# EasyEDA Pro project ProDoc_T527 LPDDR4 4层 模板_2024-06-06.epro, board PCB2
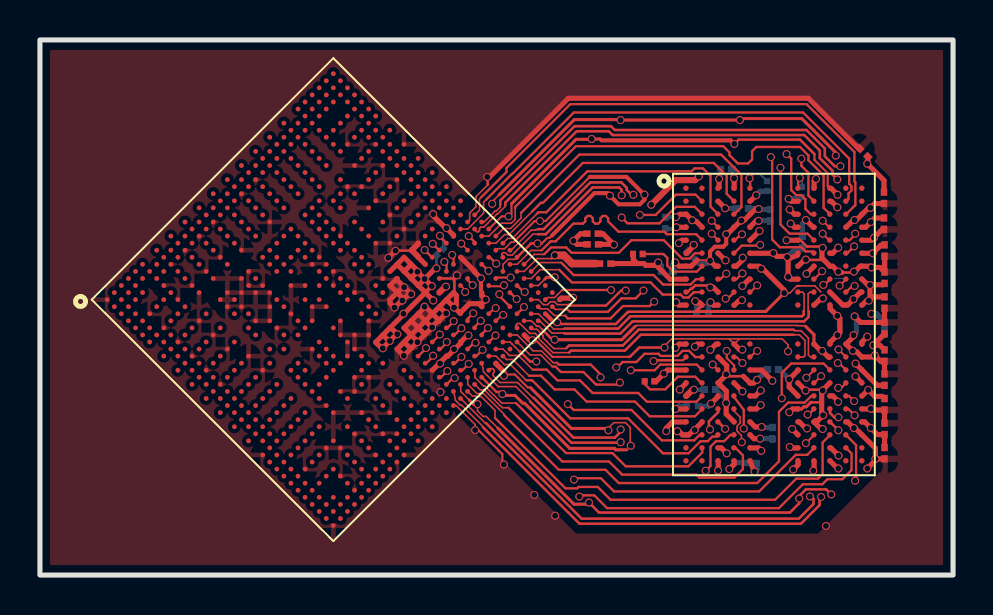
[diagram p1: board, top side]
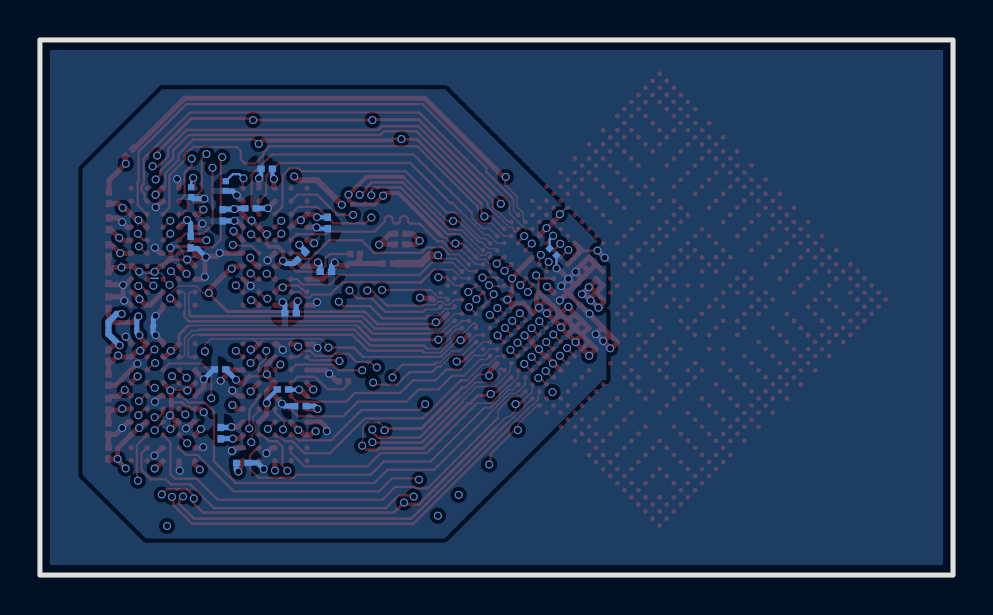
[diagram p2: board, bottom side, seen from below]

Outline 45.69 x 26.8 mm; copper layers: Top Layer, Inner1, Inner2, Bottom Layer. Coordinates in mm from the lower left corner of the outline.
Outline path: rectangle 0,26.8 45.69,0
Stack: Top Layer 0.035mm 外层铜厚1oz / Dielectric1 0.2104mm 7628 RC49% 8.6mil / Inner1 0.0152mm 内层铜厚 / Dielectric2 1.065mm 1.1mm H/HOZ 含铜 / Inner2 0.0152mm 内层铜厚 / Dielectric3 0.2104mm 7628 RC49% 8.6mil / Bottom Layer 0.035mm 外层铜厚1oz

## Design rules (mm)
template: 6L BGA
spacing safeClearance (default): track to track 0.076, other pairs 0.076 to 0.3
track width trackWidth (default): min 0.076, default 0.102, max 2.54
differential pair differentialPair (default): width min 0.102, default 0.254, max 2.54; gap min 0.102, default 0.102
via viaSize (default): diameter min 0.381, default 0.45, max 10; hole min 0.201, default 0.201, max 5.999
net GND uses DRAMCopper
pour e3959 uses DRAMCopper
pour e3975 uses DRAMCopper

## Placement (name value [footprint] x y rotation side)
C1  2.2uF  [c0201 nsk]  42.27 13.64 270 top
C2  2.2uF  [c0201 nsk]  42.27 6.1 270 top
C3  100nF  [c0201 nsk]  42.27 14.88 270 top
C4  100nF  [c0201 nsk]  42.27 9.78 270 top
C5  100nF  [c0201 nsk]  28.3 15.6 0 top
C6  2.2uF  [c0201 nsk]  41.22 21.16 135 top
C7  100nF  [c0201 nsk]  42.24 18.9 90 top
C8  2.2uF  [c0201 nsk]  42.27 12.37 90 top
C9  100nF  [c0201 nsk]  42.27 16.26 90 top
C10  100nF  [c0201 nsk]  32.61 15.98 135 bottom
C11  100nF  [c0201 nsk]  42.27 8.56 90 top
C12  100nF  [c0201 nsk]  42.27 11 90 top
C13  100nF  [c0201 nsk]  33.53 9.3 180 bottom
C14  2.2uF  [c0201 nsk]  34.34 20.34 180 bottom
C15  2.2uF  [c0201 nsk]  33.15 13.11 180 bottom
C16  100nF  [c0201 nsk]  31.29 17.63 270 bottom
C17  100nF  [c0201 nsk]  42.24 17.6 90 top
C18  100nF  [c0201 nsk]  42.27 7.31 270 top
C19  2.2uF  [c0201 nsk]  31.39 15.19 0 bottom
C20  100nF  [c0201 nsk]  36.68 10.3 0 bottom
C21  100nF  [c0201 nsk]  35.56 5.61 180 bottom
C22  100nF  [c0201 nsk]  32.66 8.46 0 bottom
C23  100nF  [c0201 nsk]  38.15 16.66 270 bottom
C24  100nF  [c0201 nsk]  36.65 7.11 90 bottom
C25  100nF  [c0201 nsk]  36.55 18.01 270 bottom
C26  100nF  [c0201 nsk]  35.15 18.36 180 bottom
C27  2.2uF  [c0201 nsk]  27.66 17.09 0 top
C28  100nF  [c0201 nsk]  27.66 16.56 180 top
R1  0  [r0201 nsk]  29.92 16.08 180 top
R2  0  [r0201 nsk]  30.51 9.7 0 top
R3  120  [r0201 nsk]  20.01 16.18 225 bottom
R4  240  [r0201 nsk]  36.4 19.48 270 bottom
R5  240  [r0201 nsk]  38.13 19.18 270 bottom
U1  T527  [T527-BGA664]  14.68 13.79 45 top
UD1  LPDDR4_FBGA200  [BGA200P65_80B1000_1500H90]  36.73 12.55 0 top

## Footprints (pads in the part's own frame, mm; a bottom-side part is the same pattern mirrored in y, then rotated)
BGA200P65_80B1000_1500H90
  round 0.27 smd: A1(-4.4,6.825) A2(-3.6,6.825) A3(-2.8,6.825) A4(-2,6.825) A5(-1.2,6.825) A8(1.2,6.825) A9(2,6.825) A10(2.8,6.825) A11(3.6,6.825) A12(4.4,6.825) AA1(-4.4,-6.175) AA2(-3.6,-6.175) AA3(-2.8,-6.175) AA4(-2,-6.175) AA5(-1.2,-6.175) AA8(1.2,-6.175) AA9(2,-6.175) AA10(2.8,-6.175) AA11(3.6,-6.175) AA12(4.4,-6.175) AB1(-4.4,-6.825) AB2(-3.6,-6.825) AB3(-2.8,-6.825) AB4(-2,-6.825) AB5(-1.2,-6.825) AB8(1.2,-6.825) AB9(2,-6.825) AB10(2.8,-6.825) AB11(3.6,-6.825) AB12(4.4,-6.825) B1(-4.4,6.175) B2(-3.6,6.175) B3(-2.8,6.175) B4(-2,6.175) B5(-1.2,6.175) B8(1.2,6.175) B9(2,6.175) B10(2.8,6.175) B11(3.6,6.175) B12(4.4,6.175) C1(-4.4,5.525) C2(-3.6,5.525) C3(-2.8,5.525) C4(-2,5.525) C5(-1.2,5.525) C8(1.2,5.525) C9(2,5.525) C10(2.8,5.525) C11(3.6,5.525) C12(4.4,5.525) D1(-4.4,4.875) D2(-3.6,4.875) D3(-2.8,4.875) D4(-2,4.875) D5(-1.2,4.875) D8(1.2,4.875) D9(2,4.875) D10(2.8,4.875) D11(3.6,4.875) D12(4.4,4.875) E1(-4.4,4.225) E2(-3.6,4.225) E3(-2.8,4.225) E4(-2,4.225) E5(-1.2,4.225) E8(1.2,4.225) E9(2,4.225) E10(2.8,4.225) E11(3.6,4.225) E12(4.4,4.225) F1(-4.4,3.575) F2(-3.6,3.575) F3(-2.8,3.575) F4(-2,3.575) F5(-1.2,3.575) F8(1.2,3.575) F9(2,3.575) F10(2.8,3.575) F11(3.6,3.575) F12(4.4,3.575) G1(-4.4,2.925) G2(-3.6,2.925) G3(-2.8,2.925) G4(-2,2.925) G5(-1.2,2.925) G8(1.2,2.925) G9(2,2.925) G10(2.8,2.925) G11(3.6,2.925) G12(4.4,2.925) H1(-4.4,2.275) H2(-3.6,2.275) H3(-2.8,2.275) H4(-2,2.275) H5(-1.2,2.275) H8(1.2,2.275) H9(2,2.275) H10(2.8,2.275) H11(3.6,2.275) H12(4.4,2.275) J1(-4.4,1.625) J2(-3.6,1.625) J3(-2.8,1.625) J4(-2,1.625) J5(-1.2,1.625) J8(1.2,1.625) J9(2,1.625) J10(2.8,1.625) J11(3.6,1.625) J12(4.4,1.625) K1(-4.4,0.975) K2(-3.6,0.975) K3(-2.8,0.975) K4(-2,0.975) K5(-1.2,0.975) K8(1.2,0.975) K9(2,0.975) K10(2.8,0.975) K11(3.6,0.975) K12(4.4,0.975) N1(-4.4,-0.975) N2(-3.6,-0.975) N3(-2.8,-0.975) N4(-2,-0.975) N5(-1.2,-0.975) N8(1.2,-0.975) N9(2,-0.975) N10(2.8,-0.975) N11(3.6,-0.975) N12(4.4,-0.975) P1(-4.4,-1.625) P2(-3.6,-1.625) P3(-2.8,-1.625) P4(-2,-1.625) P5(-1.2,-1.625) P8(1.2,-1.625) P9(2,-1.625) P10(2.8,-1.625) P11(3.6,-1.625) P12(4.4,-1.625) R1(-4.4,-2.275) R2(-3.6,-2.275) R3(-2.8,-2.275) R4(-2,-2.275) R5(-1.2,-2.275) R8(1.2,-2.275) R9(2,-2.275) R10(2.8,-2.275) R11(3.6,-2.275) R12(4.4,-2.275) T1(-4.4,-2.925) T2(-3.6,-2.925) T3(-2.8,-2.925) T4(-2,-2.925) T5(-1.2,-2.925) T8(1.2,-2.925) T9(2,-2.925) T10(2.8,-2.925) T11(3.6,-2.925) T12(4.4,-2.925) U1(-4.4,-3.575) U2(-3.6,-3.575) U3(-2.8,-3.575) U4(-2,-3.575) U5(-1.2,-3.575) U8(1.2,-3.575) U9(2,-3.575) U10(2.8,-3.575) U11(3.6,-3.575) U12(4.4,-3.575) V1(-4.4,-4.225) V2(-3.6,-4.225) V3(-2.8,-4.225) V4(-2,-4.225) V5(-1.2,-4.225) V8(1.2,-4.225) V9(2,-4.225) V10(2.8,-4.225) V11(3.6,-4.225) V12(4.4,-4.225) W1(-4.4,-4.875) W2(-3.6,-4.875) W3(-2.8,-4.875) W4(-2,-4.875) W5(-1.2,-4.875) W8(1.2,-4.875) W9(2,-4.875) W10(2.8,-4.875) W11(3.6,-4.875) W12(4.4,-4.875) Y1(-4.4,-5.525) Y2(-3.6,-5.525) Y3(-2.8,-5.525) Y4(-2,-5.525) Y5(-1.2,-5.525) Y8(1.2,-5.525) Y9(2,-5.525) Y10(2.8,-5.525) Y11(3.6,-5.525) Y12(4.4,-5.525)
c0201 nsk
  rect 0.368x0.324 smd: 1(-0.292,0) 2(0.28,0)
r0201 nsk
  rect 0.303x0.324 smd: 1(-0.241,0) 2(0.241,0)
T527-BGA664
  round 0.239 smd: A1(-8,8) A2(-7.5,8) A3(-7,8) A4(-6.5,8) A5(-6,8) A6(-5.5,8) A8(-4.5,8) A10(-3.5,8) A12(-2.5,8) A14(-1.5,8) A16(-0.5,8) A18(0.5,8) A20(1.5,8) A22(2.5,8) A24(3.5,8) A26(4.5,8) A28(5.5,8) A29(6,8) A30(6.5,8) A31(7,8) A32(7.5,8) A33(8,8) AA1(-8,-2) AA2(-7.5,-2) AA3(-7,-2) AA4(-6.5,-2) AA5(-6,-2) AA6(-5.5,-2) AA7(-5,-2) AA9(-4,-2) AA12(-2.5,-2) AA13(-2,-2) AA15(-1,-2) AA16(-0.5,-2) AA18(0.5,-2) AA19(1,-2) AA21(2,-2) AA22(2.5,-2) AA24(3.5,-2) AA26(4.5,-2) AA27(5,-2) AA28(5.5,-2) AA29(6,-2) AA30(6.5,-2) AA31(7,-2) AA32(7.5,-2) AA33(8,-2) AB2(-7.5,-2.501) AB3(-7,-2.5) AB9(-4,-2.501) AB10(-3.5,-2.5) AB11(-3,-2.5) AB12(-2.5,-2.5) AB13(-2,-2.5) AB14(-1.5,-2.5) AB15(-1,-2.5) AB17(0,-2.5) AB24(3.5,-2.5) AB32(7.5,-2.501) AB33(8,-2.5) AC1(-8,-3) AC2(-7.5,-3) AC3(-7,-3) AC4(-6.5,-3) AC5(-6,-3) AC6(-5.5,-3) AC7(-5,-3) AC9(-4,-3) AC15(-1,-3) AC17(0,-3) AC18(0.5,-3) AC19(1,-3) AC20(1.5,-3) AC22(2.5,-3) AC24(3.5,-3) AC26(4.5,-3) AC27(5,-3) AC28(5.5,-3) AC29(6,-3) AC30(6.5,-3) AC31(7,-3) AC32(7.5,-3) AC33(8,-3) AD1(-8,-3.5) AD2(-7.5,-3.5) AD9(-4,-3.5) AD11(-3,-3.5) AD13(-2,-3.5) AD14(-1.5,-3.5) AD15(-1,-3.5) AD20(1.5,-3.5) AD21(2,-3.5) AD22(2.5,-3.5) AD25(4,-3.5) AD32(7.5,-3.5) AD33(8,-3.5) AE1(-8,-4) AE2(-7.5,-4) AE3(-7,-4) AE4(-6.5,-4) AE5(-6,-4) AE6(-5.5,-4) AE7(-5,-4) AE9(-4,-4) AE11(-3,-4) AE12(-2.501,-4) AE13(-2,-4) AE14(-1.5,-4) AE16(-0.5,-4) AE18(0.5,-4) AE19(1,-4) AE20(1.5,-4) AE21(2,-4) AE22(2.501,-4) AE23(3,-4) AE24(3.5,-4) AE25(4,-4) AE26(4.5,-4) AE27(5,-4) AE28(5.5,-4) AE29(6,-4) AE30(6.5,-4) AE31(7,-4) AE32(7.5,-4) AE33(8,-4) AF1(-8,-4.5) AF2(-7.5,-4.5) AF32(7.5,-4.5) AF33(8,-4.5) AG1(-8,-5) AG2(-7.5,-5) AG3(-7,-5) AG4(-6.5,-5) AG5(-6,-5) AG6(-5.5,-5) AG7(-5,-5) AG9(-4,-5) AG11(-3,-5) AG13(-2,-5) AG15(-1,-5) AG17(0,-5) AG19(1,-5) AG21(2,-5) AG23(3,-5) AG25(4,-5) AG28(5.5,-5) AG29(6,-5) AG30(6.5,-5) AG31(7,-5) AG32(7.5,-5) AG33(8,-5) AH1(-8,-5.5) AH2(-7.5,-5.5) AH7(-5,-5.5) AH9(-4,-5.5) AH11(-3,-5.5) AH13(-2,-5.5) AH15(-1,-5.5) AH17(0,-5.5) AH19(1,-5.5) AH21(2,-5.5) AH23(3,-5.5) AH25(4,-5.5) AH27(5,-5.5) AH32(7.5,-5.5) AH33(8,-5.5) AJ1(-8,-6) AJ2(-7.5,-6) AJ3(-7,-6) AJ4(-6.5,-6) AJ5(-6,-6) AJ7(-5,-6) AJ9(-4,-6) AJ11(-3,-6) AJ13(-2,-6) AJ15(-1,-6) AJ17(0,-6) AJ19(1,-6) AJ21(2,-6) AJ23(3,-6) AJ25(4,-6) AJ27(5,-6) AJ30(6.5,-6) AJ31(7,-6) AJ32(7.5,-6) AJ33(8,-6) AK1(-8,-6.5) AK2(-7.5,-6.5) AK5(-6,-6.5) AK7(-5,-6.5) AK9(-4,-6.5) AK11(-3,-6.5) AK13(-2,-6.5) AK15(-1,-6.5) AK17(0,-6.501) AK19(1,-6.5) AK21(2,-6.5) AK23(3,-6.5) AK25(4,-6.5) AK27(5,-6.5) AK29(6,-6.5) AK32(7.5,-6.5) AK33(8,-6.5) AL1(-8,-7) AL2(-7.5,-7) AL3(-7,-7) AL5(-6,-7) AL7(-5,-7) AL9(-4,-7) AL11(-3,-7) AL12(-2.5,-7) AL13(-2,-7) AL14(-1.5,-7) AL15(-1,-7) AL16(-0.5,-7) AL17(0,-7) AL19(1,-7) AL21(2,-7) AL23(3,-7) AL25(4,-7) AL27(5,-7) AL29(6,-7) AL31(7,-7) AL32(7.5,-7) AL33(8,-7) AM1(-8,-7.5) AM2(-7.5,-7.5) AM3(-7,-7.5) AM4(-6.5,-7.5) AM5(-6,-7.5) AM6(-5.5,-7.5) AM7(-5,-7.5) AM8(-4.5,-7.5) AM9(-4,-7.5) AM10(-3.5,-7.5) AM11(-3,-7.5) AM12(-2.501,-7.5) AM13(-2,-7.5) AM14(-1.5,-7.5) AM15(-1,-7.5) AM16(-0.5,-7.5) AM17(0,-7.5) AM18(0.5,-7.5) AM19(1,-7.5) AM20(1.5,-7.5) AM21(2,-7.5) AM22(2.501,-7.5) AM23(3,-7.5) AM24(3.5,-7.5) AM25(4,-7.5) AM26(4.5,-7.5) AM27(5,-7.5) AM28(5.5,-7.5) AM29(6,-7.5) AM30(6.5,-7.5) AM31(7,-7.5) AM32(7.5,-7.5) AM33(8,-7.5) AN1(-8,-8) AN2(-7.5,-8) AN3(-7,-8) AN4(-6.5,-8) AN5(-6,-8) AN6(-5.5,-8) AN7(-5,-8) AN8(-4.5,-8) AN9(-4,-8) AN10(-3.5,-8) AN11(-3,-8) AN13(-2,-8) AN15(-1,-8) AN17(0,-8) AN18(0.5,-8) AN19(1,-8) AN20(1.5,-8) AN21(2,-8) AN22(2.5,-8) AN23(3,-8) AN24(3.5,-8) AN25(4,-8) AN26(4.5,-8) AN27(5,-8) AN28(5.5,-8) AN29(6,-8) AN30(6.5,-8) AN31(7,-8) AN32(7.5,-8) AN33(8,-8) B1(-8,7.5) B2(-7.5,7.5) B3(-7,7.5) B4(-6.5,7.5) B5(-6,7.5) B6(-5.5,7.5) B7(-5,7.5) B8(-4.5,7.5) B9(-4,7.5) B10(-3.5,7.5) B11(-3,7.5) B12(-2.501,7.5) B13(-2,7.5) B14(-1.5,7.5) B15(-1,7.5) B16(-0.5,7.5) B17(0,7.5) B18(0.5,7.5) B19(1,7.5) B20(1.5,7.5) B21(2,7.5) B22(2.501,7.5) B23(3,7.5) B24(3.5,7.5) B25(4,7.5) B26(4.5,7.5) B27(5,7.5) B28(5.5,7.5) B29(6,7.5) B30(6.5,7.5) B31(7,7.5) B32(7.5,7.5) B33(8,7.5) C1(-8,7) C2(-7.5,7) C3(-7,7) C4(-6.5,7) C6(-5.5,7) C7(-5,7) C8(-4.5,7) C9(-4,7) C10(-3.5,7) C11(-3,7) C12(-2.5,7) C13(-2,7) C14(-1.5,7) C15(-1,7) C16(-0.5,7) C17(0,7) C18(0.5,7) C19(1,7) C20(1.5,7) C21(2,7) C22(2.5,7) C23(3,7) C24(3.5,7) C25(4,7) C26(4.5,7) C27(5,7) C28(5.5,7) C29(6,7) C30(6.5,7) C31(7,7) C32(7.5,7) C33(8,7) D1(-8,6.5) D2(-7.5,6.5) D6(-5.5,6.5) D8(-4.5,6.5) D10(-3.5,6.5) D12(-2.5,6.501) D14(-1.5,6.5) D16(-0.5,6.5) D18(0.5,6.5) D20(1.5,6.5) D22(2.5,6.501) D24(3.5,6.5) D26(4.5,6.5) D28(5.5,6.5) D32(7.5,6.5) D33(8,6.5) E1(-8,6) E2(-7.5,6) E3(-7,6) E4(-6.5,6) E5(-6,6) E6(-5.5,6) E8(-4.5,6) E10(-3.5,6) E12(-2.5,6) E14(-1.5,6) E16(-0.5,6) E18(0.5,6) E20(1.5,6) E22(2.5,6) E24(3.5,6) E26(4.5,6) E28(5.5,6) E29(6,6) E30(6.5,6) E31(7,6) E32(7.5,6) E33(8,6) F1(-8,5.5) F2(-7.5,5.5) F6(-5.5,5.5) F8(-4.5,5.5) F10(-3.5,5.5) F12(-2.5,5.5) F14(-1.5,5.5) F16(-0.5,5.5) F18(0.5,5.5) F20(1.5,5.5) F22(2.5,5.5) F24(3.5,5.5) F26(4.5,5.5) F28(5.5,5.5) F32(7.5,5.5) F33(8,5.5) G1(-8,5) G2(-7.5,5) G3(-7,5) G4(-6.5,5) G5(-6,5) G6(-5.5,5) G8(-4.5,5) G10(-3.5,5) G12(-2.5,5) G14(-1.5,5) G16(-0.5,5) G18(0.5,5) G20(1.5,5) G22(2.5,5) G24(3.5,5) G26(4.5,5) G28(5.5,5) G29(6,5) G30(6.5,5) G31(7,5) G32(7.5,5) G33(8,5) H2(-7.5,4.5) H3(-7,4.5) H24(3.5,4.5) H31(7,4.5) H32(7.5,4.5) J1(-8,4) J2(-7.5,4) J3(-7,4) J4(-6.5,4) J5(-6,4) J6(-5.5,4) J7(-5,4) J9(-4,4) J10(-3.5,4) J12(-2.501,4) J13(-2,4) J15(-1,4) J16(-0.5,4) J17(0,4) J18(0.5,4) J19(1,4) J21(2,4) J22(2.501,4) J23(3,4) J26(4.5,4) J28(5.5,4) J29(6,4) J30(6.5,4) J31(7,4) J32(7.5,4) J33(8,4) K2(-7.5,3.5) K3(-7,3.5) K9(-4,3.5) K10(-3.5,3.5) K11(-3,3.5) K12(-2.5,3.5) K13(-2,3.5) K15(-1,3.5) K16(-0.5,3.5) K19(1,3.5) K21(2,3.5) K22(2.5,3.5) K24(3.5,3.5) K25(4,3.5) K26(4.5,3.5) K31(7,3.5) K32(7.5,3.5) L1(-8,3) L2(-7.5,3) L3(-7,3) L4(-6.5,3) L5(-6,3) L6(-5.5,3) L7(-5,3) L9(-4,3) L10(-3.5,3) L12(-2.5,3) L13(-2,3) L15(-1,3) L16(-0.5,3) L17(0,3) L18(0.5,3) L19(1,3) L21(2,3) L22(2.5,3) L24(3.5,3) L26(4.5,3) L27(5,3) L28(5.5,3) L29(6,3) L30(6.5,3) L31(7,3) L32(7.5,3) L33(8,3) M2(-7.5,2.501) M3(-7,2.5) M10(-3.5,2.5) M13(-2,2.5) M16(-0.5,2.5) M18(0.5,2.5) M19(1,2.5) M21(2,2.5) M22(2.5,2.5) M31(7,2.5) M32(7.5,2.501) N1(-8,2) N2(-7.5,2) N3(-7,2) N4(-6.5,2) N5(-6,2) N6(-5.5,2) N7(-5,2) N9(-4,2) N10(-3.5,2) N12(-2.5,2) N13(-2,2) N15(-1,2) N18(0.5,2) N19(1,2) N21(2,2) N22(2.5,2) N24(3.5,2) N26(4.5,2) N27(5,2) N28(5.5,2) N29(6,2) N30(6.5,2) N31(7,2) N32(7.5,2) N33(8,2) P2(-7.5,1.5) P3(-7,1.5) P9(-4,1.5) P11(-3,1.5) P13(-2,1.5) P16(-0.5,1.5) P18(0.5,1.5) P19(1,1.5) P21(2,1.5) P22(2.5,1.5) P24(3.5,1.5) P31(7,1.5) P32(7.5,1.5) R1(-8,1) R2(-7.5,1) R3(-7,1) R4(-6.5,1) R5(-6,1) R6(-5.5,1) R7(-5,1) R11(-3,1) R13(-2,1) R15(-1,1) R17(0,1) R18(0.5,1) R19(1,1) R22(2.5,1) R24(3.5,1) R26(4.5,1) R27(5,1) R28(5.5,1) R29(6,1) R30(6.5,1) R31(7,1) R32(7.5,1) R33(8,1) T2(-7.5,0.5) T3(-7,0.5) T9(-4,0.5) T11(-3,0.5) T13(-2,0.5) T15(-1,0.5) T16(-0.5,0.5) T18(0.5,0.5) T19(1,0.5) T21(2,0.5) T22(2.5,0.5) T24(3.5,0.5) T31(7,0.5) T32(7.5,0.5) U1(-8,0) U2(-7.5,0) U3(-7,0) U4(-6.501,0) U5(-6,0) U6(-5.5,0) U7(-5,0) U8(-4.5,0) U10(-3.5,0) U12(-2.5,0) U13(-2,0) U14(-1.5,0) U16(-0.5,0) U18(0.5,0) U19(1,0) U21(2,0) U22(2.5,0) U25(4,0) U26(4.5,0) U27(5,0) U28(5.5,0) U29(6,0) U30(6.501,0) U31(7,0) U32(7.5,0) U33(8,0) V2(-7.5,-0.5) V3(-7,-0.5) V18(0.5,-0.5) V19(1,-0.5) V31(7,-0.5) V32(7.5,-0.5) W1(-8,-1) W2(-7.5,-1) W3(-7,-1) W4(-6.5,-1) W5(-6,-1) W6(-5.5,-1) W7(-5,-1) W9(-4,-1) W10(-3.5,-1) W12(-2.5,-1) W13(-2,-1) W15(-1,-1) W16(-0.5,-1) W19(1,-1) W21(2,-1) W22(2.5,-1) W23(3,-1) W24(3.5,-1) W25(4,-1) W27(5,-1) W28(5.5,-1) W29(6,-1) W30(6.5,-1) W31(7,-1) W32(7.5,-1) W33(8,-1) Y2(-7.5,-1.5) Y3(-7,-1.5) Y9(-4,-1.5) Y10(-3.5,-1.5) Y12(-2.5,-1.5) Y13(-2,-1.5) Y15(-1,-1.5) Y18(0.5,-1.5) Y19(1,-1.5) Y21(2,-1.5) Y22(2.5,-1.5) Y23(3,-1.5) Y24(3.5,-1.5) Y26(4.5,-1.5) Y31(7,-1.5) Y32(7.5,-1.5)

## Nets
As in the schematic.

Pads without a net: U1 A2 A3 A4 A5 A6 A8 A10 A12 A14 A16 A18 A20 A22 A24 A26 A28 A29 A30 A31 A32 A33 AA1 AA2 AA3 AA4 AA5 AA6 AA7 AA9 AA12 AA13 AA19 AB2 AB3 AB9 AB13 AC2 AC3 AC4 AC5 AC6 AC7 AC9 AC15 AD1 AD2 AD15 AE1 AE2 AE3 AE4 AE5 AE6 AE7 AE11 AE13 AE16 AF1 AF2 AG1 AG2 AG4 AG5 AG9 AG13 AG15 AG17 AH1 AH2 AH11 AH13 AH15 AH17 AJ1 AJ2 AJ3 AJ4 AJ5 AJ7 AJ9 AJ11 AJ15 AJ17 AK1 AK2 AK7 AK9 AK13 AK15 AK17 AK33 AL1 AL2 AL5 AL7 AL11 AL15 AL16 AL17 AL27 AL32 AL33 AM1 AM2 AM3 AM4 AM6 AM7 AM8 AM9 AM10 AM11 AM12 AM13 AM14 AM15 AM16 AM17 AM18 AM33 AN2 AN3 AN4 AN5 AN6 AN7 AN8 AN9 AN13 AN15 AN17 AN26 B1 B2 B3 B4 B5 B6 B7 B8 B9 B10 B11 B12 B13 B14 B15 B16 B17 B18 B19 B20 B21 B22 B23 B24 B25 B26 B27 B28 B29 B30 B31 B32 B33 C1 C2 C3 C4 C7 C9 C11 C13 C15 C16 C17 C19 C21 C22 C23 C24 C25 C26 C27 C28 C29 C30 C31 C32 C33 D1 D2 D8 D10 D12 D14 D16 D18 D20 D22 D24 D26 D28 D32 D33 E1 E2 E4 E5 E6 E8 E10 E12 E14 E16 E18 E20 E22 E24 E26 E28 E29 E30 E31 E32 E33 F1 F2 F14 F16 F18 F20 F22 F24 F26 F28 F32 F33 G1 G2 G4 G5 G6 G12 G16 G20 G22 G24 G26 G28 G30 G31 G32 G33 H2 H3 H24 H31 H32 J1 J2 J4 J5 J7 J15 J16 J17 J18 J19 J21 J22 J23 J26 J29 J30 J32 J33 K2 K3 K13 K15 K16 K19 K21 K22 K24 K25 K31 K32 L1 L2 L4 L5 L7 L9 L15 L16 L17 L18 L19 L21 L22 L24 L26 L28 L29 L31 L32 M2 M3 M10 M16 M18 M19 M21 M22 M31 M32 N1 N2 N4 N5 N7 N9 N13 N21 N24 N28 N29 N31 N32 N33 P2 P3 P9 P13 P18 P21 P22 P31 P32 R1 R2 R4 R5 R6 R15 R17 R18 R22 R26 R28 R29 R30 R31 R32 R33 T2 T3 T9 T11 T13 T19 T21 T22 T31 T32 U1 U2 U3 U4 U5 U6 U8 U10 U12 U13 U18 U19 U21 U22 U26 U28 U29 U30 U31 U32 U33 V2 V3 V31 V32 W1 W2 W3 W4 W5 W6 W7 W9 W10 W19 W21 W28 W29 W31 W32 W33 Y2 Y3 Y9 Y10 Y12 Y13 Y19 Y21 Y31 Y32; UD1 A1 A2 A11 A12 AA1 AA12 AB1 AB2 AB11 AB12 B1 B12 G11 K5 K8 N5 N8

## Via types
v1: diameter 0.4, hole 0.3, Top Layer to Bottom Layer, 283 vias

## Routing (per net, layer and track width the routed paths; a pad name or vN(x,y) marks a point on that pad's centre or on a via; arc(x,y) is an arc through that point)
GND: length 299.7
  Top Layer w0.076: 21.41,17.68 21.5,17.78 21.5,18.13 21.82,18.45 21.82,18.95 22.41,19.54 ; 35,11.83 34.74,11.57 34.48,11.83 ; 35,11.83 34.48,11.83 ; 35,11.83 37.14,11.83 37.44,11.53 v1(37.44,11.2) ; v1(33.53,15.74) 33.5,15.77 32.9,15.77 ; v1(29.57,6.48) 29.54,6.5 29.54,7.39 29.3,7.63 28.71,7.63 28.42,7.34 ; 25.26,14.82 24.94,14.5 24.59,14.5 ; 23.88,15.21 24.24,15.21 24.88,15.85 25.61,15.85 ; 25.14,12.29 24.96,12.47 24.87,12.47 24.84,12.48 24.59,12.73 24.24,12.73 ; 22.39,19.93 v1(22.38,19.94) 22.37,19.94 22.37,19.79 ; 38.29,12.49 37.91,12.49 37.9,12.5 29.88,12.5 29.87,12.49 29.82,12.49 ; 23.7,16.67 23.58,16.67 23.25,16.34 22.9,16.34 22.82,16.27 ; 23.17,15.21 23.17,15.56 23.43,15.81 23.78,15.81 23.88,15.91 ; v1(37.24,14.12) 37.52,14.12 37.88,14.48 37.89,14.48 ; 20.7,8.49 20.83,8.49 21.78,7.54 v1(21.78,7.26) ; 39.06,14.17 39.06,14.2 38.78,14.48 38.01,14.48 ; 34.48,11.83 31.61,11.83 31.26,11.47 v1(31.26,11.39) ; v1(28.45,7.25) 28.54,7.25 ; 22.92,7.36 22.33,7.94 22.18,7.94 21.89,8.23 v1(21.89,8.56) ; v1(22.63,18.59) 22.63,18.7 22.97,19.04 ; 21.05,9.55 21.05,9.2 21.49,8.76 ; 24,11.2 23.78,11.42 23.78,11.42 23.63,11.57 23.63,11.57 23.52,11.67 23.17,11.67
  Top Layer w0.102: 23.7,16.67 24.75,17.72 25.01,17.72 v1(25.02,17.73) 25.31,17.73 27.52,19.94 ; 29.48,10.93 25.65,10.93 24.81,11.76 v1(24.65,11.76) ; 23.6,18.59 23.6,18.1 v1(23.45,17.96) 23.45,17.96 23.1,17.96 22.47,17.33 ; 38.29,12.49 38.33,12.45 ; v1(23.22,5.54) 23.14,5.61 23.14,6.06 22.97,6.23 22.97,6.23 21.94,7.26 v1(21.78,7.26) ; 24.56,9.37 24.54,9.4 24.41,9.4 23.76,10.05 23.11,10.05 ; 37.89,14.48 38.01,14.48 ; 38.76,21.08 38.76,20.79 39.42,20.13 39.42,19.49 39.54,19.37 ; v1(24.9,16.61) 25.12,16.61 25.39,16.88 25.46,16.88 25.48,16.9 25.52,16.9 25.62,17 ; 31.55,10.76 32.18,10.76 32.34,10.92 ; 29.78,12.45 29.82,12.49
  Top Layer w0.115: v1(23.14,9.07) 23.04,9.17 22.85,9.17 22.11,9.9
  Top Layer w0.127: 25.61,15.85 v1(25.77,16.01) ; 40.13,15.15 40.73,15.15 ; 38.76,21.08 38.03,21.81 34.96,21.81 v1(34.75,21.59) ; 35.2,9.96 34.44,9.96 v1(34.34,10.05) ; v1(30.71,10.72) 30.75,10.76 31.55,10.76 ; 20.74,14.88 20.74,14.19 20.7,14.15 ; 20.74,14.88 v1(20.87,15.01) ; 20.74,14.88 20.71,14.85 19.99,14.85 ; 24,11.2 24.03,11.2 24.53,10.69 v1(24.84,10.69) ; v1(39.17,9.25) 39.14,9.28 38.36,9.28 v1(38.32,9.24) ; v1(27.47,3.63) 27.98,3.13 37.53,3.13 38,3.6 v1(38,3.84) 38,3.96 38.33,4.29 39.34,4.29 v1(39.6,4.04) ; 18.6,16.24 17.8,16.24 v1(17.79,16.25) ; 39.12,8.67 39.1,8.65 38.63,8.65 ; 32.95,13.21 32.92,13.19 29.46,13.19 29.42,13.15 29.4,13.15 28.82,12.57 25.97,12.57 v1(25.88,12.66) ; v1(39.17,16.38) 39.12,16.38 39.05,16.45 38.38,16.45 38.06,16.77 37.94,16.77 ; v1(31.26,11.39) 29.99,11.39 29.52,10.93 29.48,10.93 ; 25.14,12.29 25.64,11.79 v1(25.76,11.79) ; 23.88,15.91 24.58,16.61 v1(24.9,16.61) ; 39.23,15.78 38.35,15.78 v1(38.33,15.8) ; 32.34,14.17 32.4,14.17 32.59,14.35 32.64,14.35 32.79,14.5 33.45,14.5 v1(33.54,14.41) ; 22.41,19.54 22.41,19.84 22.36,19.89 22.39,19.93
  Top Layer w0.152: 29.78,12.45 29.12,11.79 v1(25.76,11.79) ; 22.97,19.04 26.74,22.81 28.93,22.81 28.96,22.78 v1(29.06,22.78) v1(35.03,22.78) 35.1,22.86 38.12,22.86 39.83,21.16 v1(39.83,21.01) ; 28.11,21.77 28.04,21.84 v1(27.61,21.84) 27.59,21.82 26.82,21.82 23.6,18.59 ; 28.42,7.34 26.59,7.34 24.56,9.37 ; UD1.N9 38.74,11.58 38.74,12.04 38.33,12.45 ; v1(25.76,14.91) 25.35,14.91 25.26,14.82 ; v1(27.47,3.63) 27.42,3.63 27.33,3.55 26.72,3.55 22.92,7.36 ; 21.49,8.76 21.69,8.56 v1(21.89,8.56) ; v1(23.14,9.07) 23.21,9 23.77,9 24.16,8.6 24.25,8.6 26.51,6.34 28.75,6.34 28.82,6.27 29.36,6.27 ; 38.63,8.65 38.58,8.65 38.36,8.43 38.22,8.43 38.11,8.32 37.94,8.32 ; 33.14,13.52 32.83,13.2 36.32,13.2 v1(37.24,14.12)
  Top Layer w0.203: 27.52,19.94 29.35,19.94 30.24,19.05 v1(30.25,19.05) 30.25,18.8 30.02,18.57 28.96,18.57 v1(28.52,19) 28.4,19.13 27.75,19.13 25.62,17 ; v1(34.75,21.59) 34.57,21.77 28.11,21.77 ; v1(25.88,12.66) 25.72,12.66 25.3,13.09 ; v1(22.07,14.86) 22.07,14.19 22.11,14.15 ; v1(34.34,17.07) 34.34,16.59 34.2,16.44 33.78,16.44 33.53,16.2 v1(33.53,15.74)
  Top Layer w0.254: 42.24,15.94 42.27,15.91 C3.1 42.04,15.4 v1(41.62,15.4) 41.55,15.47 41.05,15.47 40.78,15.19 ; v1(33.54,14.41) 33.7,14.41 33.94,14.17 ; 18.89,11.71 18.94,11.71 v1(19.63,12.4) ; 18.89,11.71 v1(18.89,11.66) 18.59,11.36 ; 18.89,11.71 18.58,12.02 ; 18.93,15.91 19.29,15.56 ; 18.93,15.91 18.6,16.24 18.63,16.27 ; 18.93,15.91 18.93,15.96 18.63,16.27 ; 40.13,15.15 39.99,15.15 v1(39.95,15.19) 39.67,15.47 39.54,15.47 39.23,15.78 39.13,15.87 39.13,16.3 39.17,16.33 39.17,16.38 v1(39.17,16.38) ; 32.34,16.77 32.12,16.77 v1(31.97,16.62) ; 33.94,10.92 34.37,10.49 34.37,10.08 v1(34.34,10.05) 34.34,10.05 34.34,10.01 33.94,9.62 34.35,9.21 34.35,8.69 34.34,8.69 v1(34.34,8.61) 34.34,8.07 34.74,7.67 ; 34.74,13.52 34.75,13.52 34.95,13.72 35.08,13.72 v1(35.13,13.77) ; 33.14,11.57 32.9,11.57 v1(32.78,11.44) ; v1(35.89,9.78) 35.72,9.62 35.54,9.62 35.2,9.96 ; 18.59,11.36 18.54,11.36 18.22,11.67 ; 18.59,11.36 v1(18.21,10.98) 17.87,11.32 18.22,11.67 ; 17.87,14.15 18.14,14.42 v1(18.23,14.42) ; 17.87,14.15 18.14,13.88 v1(18.14,13.75) ; 17.87,14.15 17.52,13.79 17.52,13.61 v1(17.74,13.39) 18.1,13.75 v1(18.14,13.75) ; 17.87,14.15 17.52,14.5 17.87,14.85 ; 34.74,11.57 35,11.3 35.13,11.3 35.14,11.29 v1(35.15,11.29) ; 19.29,12.73 19.64,13.09 ; 19.29,12.73 19.61,12.4 v1(19.63,12.4) ; 19.29,12.73 18.93,13.09 ; 19.29,12.73 18.93,12.38 ; 19.64,13.09 19.99,13.44 ; 19.64,13.09 19.98,12.74 ; 19.64,13.09 19.25,13.48 v1(19.25,13.44) 19.2,13.39 19.2,13.35 18.93,13.09 ; v1(31.79,15.66) 31.98,15.47 32.59,15.47 32.9,15.77 ; v1(41.4,5.34) 41.81,5.74 v1(41.81,5.82) ; 35.54,8.32 35.85,8.32 36.04,8.51 36.06,8.51 v1(36.07,8.52) ; 37.94,5.72 37.94,5.53 v1(37.7,5.28) ; 18.22,11.67 18.58,12.02 ; 41.14,16.77 41.61,16.77 v1(41.73,16.89) 42.15,17.31 C17.1 ; C18.1 C11.1 41.64,8.27 v1(41.58,8.33) 41.56,8.32 41.14,8.32 ; C1.2 C8.2 41.07,12.65 v1(40.77,12.95) ; UD1.J10 40.18,13.52 UD1.K11 40.42,13.52 v1(40.72,13.82) 41.07,14.17 UD1.J12 ; 37.94,9.62 v1(38.32,9.24) ; 33.94,19.37 33.99,19.41 v1(33.99,19.84) ; v1(39.17,7.31) 39.09,7.31 38.74,7.67 38.8,7.72 38.91,7.72 v1(39.19,8) 39.12,8.07 39.12,9.19 v1(39.17,9.25) 39.17,9.27 UD1.T10 ; C4.1 C12.1 42.07,10.71 v1(41.78,11) 41.71,10.92 UD1.P12 40.87,11.18 40.72,11.18 v1(40.68,11.23) 40.34,11.57 40.72,11.94 v1(40.72,12.01) ; v1(32.79,13.72) 32.88,13.63 33.03,13.63 33.14,13.52 ; v1(38.33,17.78) 38.69,17.42 38.74,17.42 ; 18.63,16.27 18.6,16.29 18.93,16.62 18.93,16.57 18.63,16.27 ; v1(23.22,9.98) 23.22,10.19 22.82,10.58 22.82,10.61 ; v1(20.72,13.39) 20.84,13.51 20.84,14.01 20.7,14.15 20.35,13.79 ; v1(20.72,13.39) 20.75,13.39 21.02,13.12 21.49,13.59 21.96,13.59 22.11,13.44 22.11,13.6 v1(22.31,13.8) 22.11,13.99 22.11,14.15 ; v1(20.72,13.39) 20.72,13.5 20.64,13.5 20.35,13.79 ; v1(37.51,18.31) 37.76,18.07 37.94,18.07 ; 19.64,10.26 19.96,10.58 20.01,10.58 v1(20.02,10.59) 20.02,10.64 20.35,10.96 20.41,10.96 20.72,11.28 v1(20.72,11.31) 20.76,11.31 21.05,11.61 21.05,11.67 21.38,12 v1(21.44,12) ; v1(39.91,19.04) 39.59,19.37 39.54,19.37 ; 35.54,5.72 35.54,5.69 35.74,5.2 v1(35.76,5.18) ; 37.94,15.47 38.27,15.8 v1(38.33,15.8) ; v1(32.01,9.29) 32.34,9.62 ; 20.35,13.79 19.99,13.44 ; v1(34.34,17.07) 34.39,17.07 35.08,17.75 v1(35.1,17.75) 35.13,17.78 35.26,17.78 35.8,18.33 v1(35.97,18.33) ; 37.94,8.32 37.66,8.32 v1(37.5,8.15) ; v1(37.64,7.31) 37.94,7.02 ; 19.98,12.74 19.98,12.76 v1(20.33,13.1) 19.99,13.44 ; 19.98,12.74 19.98,12.72 19.91,12.72 19.65,12.47 19.65,12.43 v1(19.63,12.4) ; v1(18.14,13.75) 18.41,14.02 18.53,14.02 v1(18.57,14.07) v1(18.23,14.42) ; v1(20.35,17.37) 20.36,17.36 ; 20.36,17.36 20.31,17.36 19.68,18 v1(19.68,18.07) ; 20.36,17.36 20.37,17.36 ; 20.36,17.36 20.7,17.02 20.7,16.97 ; v1(40.73,15.19) 40.78,15.19 ; 40.78,15.19 40.73,15.15 ; C7.1 41.77,18.61 v1(41.56,18.39) 41.47,18.39 40.9,17.82 40.81,17.82 v1(40.77,17.78) 40.71,17.78 40.34,17.42 ; 28.7,16.56 28.17,17.09 C27.2 ; 28.7,16.56 v1(28.72,16.54) ; 28.7,16.56 C28.1 ; 21.05,15.91 21.76,15.21 21.76,15.17 v1(22.07,14.86) ; v1(37.24,14.12) 37.24,14.27 36.17,15.34 v1(36.1,15.34) 35.97,15.47 35.54,15.47 ; v1(41.81,5.82) C2.2 ; v1(41.81,5.82) 41.81,6.35 40.79,7.36 v1(40.73,7.36) 40.43,7.67 40.34,7.67 ; 18.93,13.09 18.58,12.73 ; 26,13.79 26.01,13.8 26.03,13.8 26.09,13.87 26.51,13.87 26.54,13.89 v1(26.68,13.89) ; 33.94,15.47 33.8,15.47 v1(33.53,15.74) ; v1(22.38,19.94) 22.5,19.94 26.44,23.88 38.46,23.88 41,21.33 41.06,21.38 ; 17.44,15.89 v1(17.79,16.25) ; 33.14,7.67 32.77,7.29 v1(32.77,7.26) 32.72,7.26 32.47,7.02 32.16,7.02 31.97,7.2 v1(31.9,7.2) ; v1(18.23,14.42) 17.87,14.77 17.87,14.85 ; 38.74,11.57 39.08,11.23 v1(39.14,11.23) 39.45,10.92 39.54,10.92 ; v1(39.18,13.86) 39.11,13.79 39.02,13.79 38.74,13.52 ; 35.54,7.02 35.73,6.83 v1(36.04,6.83) ; UD1.T12 41.13,9.63 v1(40.81,9.95) ; 35.54,16.77 v1(36.01,17.23) ; 18.58,12.02 18.22,12.38 18.58,12.73 ; 18.58,12.02 18.93,12.38 ; v1(37.37,16.77) 37.94,16.77 ; v1(24.65,11.76) 24.56,11.76 24.54,11.78 24.47,11.78 24.24,12.02 ; 18.93,12.38 19.27,12.04 ; 18.93,12.38 18.58,12.73 ; v1(39.96,5.33) 39.92,5.33 39.54,5.72 ; v1(33.93,5.23) 33.94,5.24 33.94,5.72 ; 33.14,17.42 32.84,17.71 32.69,17.71 v1(32.64,17.77) 32.34,18.07 32.01,18.07 31.87,17.92 v1(31.83,17.92) ; v1(31.8,8.32) 32.34,8.32
  Top Layer w0.381: v1(25.77,16.01) 26.22,16.01 26.63,15.6 27.83,15.6
  Inner1 w0.076: 40.18,10.97 40.16,10.95 39.52,10.95 39.5,10.97
  Inner2 w0.254: 22.39,19.93 20.35,17.88 v1(20.35,17.37)
  Bottom Layer w0.203: C14.2 34.06,19.91 v1(33.99,19.84) ; C16.1 31.3,17.92 v1(31.83,17.92) ; v1(34.34,8.61) 34.34,8.78 C13.1
  Bottom Layer w0.254: v1(32.79,13.72) 32.87,13.64 32.87,13.11 ; C26.1 35.93,18.36 v1(35.97,18.33) 36.52,18.33 C25.1 ; v1(35.76,5.18) 35.88,5.3 35.88,5.62 ; C20.1 36.39,10.28 v1(35.89,9.78) ; v1(31.8,8.32) 31.95,8.47 32.29,8.47 ; v1(40.72,12.01) 40.85,12.14 40.85,12.87 v1(40.77,12.95) ; v1(36.04,6.83) 36.64,6.83 C24.1 ; C23.1 38.15,17.21 38.15,17.21 38.15,17.6 v1(38.33,17.78) ; v1(31.79,15.66) 31.67,15.55 31.67,15.19 ; v1(33.53,15.74) 33.4,15.6 32.99,15.6 C10.1
  vias: v1(17.44,15.89) v1(20.04,9.16) v1(24.74,4.01) v1(25.78,2.97) v1(39.33,2.46)
VCC-DRAM: length 65.7
  Top Layer w0.203: 19.29,14.15 v1(19.61,14.47)
  Top Layer w0.254: v1(36.09,6.22) 35.95,6.37 35.54,6.37 ; v1(36.12,7.42) 35.79,7.42 35.54,7.67 ; 34.74,5.72 34.74,5.56 v1(34.5,5.31) ; v1(40.82,10.59) 41.13,10.27 UD1.R12 41.9,9.5 C4.2 ; 39.54,13.52 39.54,13.34 v1(39.9,12.98) 40.03,12.85 40.03,12.14 v1(39.9,12.01) 39.54,11.65 39.54,11.57 ; v1(34.37,6.1) 34.1,6.37 33.94,6.37 ; v1(37.39,15.93) 37.54,15.87 37.9,16.02 37.94,16.12 ; v1(37.39,15.93) 37.44,15.88 v1(37.44,14.94) 37.56,14.82 37.94,14.82 ; v1(37.39,15.93) 37.36,15.96 36.87,15.96 v1(36.7,16.13) 36.69,16.12 35.54,16.12 ; v1(34.31,15.76) 34.31,15.77 34.29,15.77 33.94,16.12 ; v1(39.94,8.67) 39.94,8.71 39.69,8.97 39.54,8.97 ; v1(19.25,14.83) 19.78,15.36 v1(19.84,15.36) ; v1(19.25,14.83) 19.25,14.82 18.93,14.5 ; v1(19.25,14.83) v1(18.89,15.19) ; v1(19.25,14.83) v1(19.61,14.47) ; 35.54,10.27 36.11,10.27 v1(36.65,9.73) ; 17.52,15.21 17.87,15.56 ; 17.87,15.56 18.22,15.21 ; 17.87,15.56 18.22,15.91 ; v1(17.51,11.72) 17.16,11.37 v1(17.16,11.35) 17.1,11.35 16.81,11.65 16.81,11.67 ; v1(17.51,11.72) 17.47,11.72 17.16,12.02 ; v1(17.51,11.72) 17.85,12.06 v1(17.88,12.06) 17.57,12.38 17.52,12.38 18.19,13.05 v1(18.19,13.09) 18.23,13.09 19.29,14.15 ; 32.34,14.82 31.54,14.82 30.94,15.42 v1(30.94,15.65) 30.8,15.51 30.31,15.51 30.22,15.6 29.89,15.6 ; v1(37.52,6.41) 37.57,6.37 37.94,6.37 ; 41.14,17.42 41.32,17.42 v1(41.58,17.68) 41.78,17.88 C17.2 ; v1(38.39,7.34) 38.33,7.34 38,7.67 37.94,7.67 ; C1.1 41.67,13.93 41.54,13.8 ; v1(41.54,14.52) 41.55,14.54 42.2,14.54 C3.2 ; v1(41.54,14.52) 41.54,13.8 ; v1(41.54,14.52) 41.43,14.52 41.14,14.82 ; 41.54,13.8 v1(41.48,13.74) 41.37,13.74 41.14,13.52 ; 18.58,14.85 18.58,14.88 v1(18.89,15.19) ; 18.58,14.85 18.22,15.21 ; 18.58,14.85 18.93,14.5 ; 33.94,8.97 33.94,8.95 v1(33.58,8.59) ; 18.22,15.21 18.56,15.54 18.56,15.58 ; v1(38.7,5.23) 38.74,5.27 38.74,5.72 ; v1(35.97,17.74) 35.84,17.74 35.54,17.44 35.54,17.42 ; 19.29,14.15 v1(19.68,13.75) ; 19.29,14.15 18.93,14.5 ; v1(39.95,16.39) 39.67,16.12 39.54,16.12 ; 32.34,10.27 31.4,10.27 v1(31.22,10.08) 30.84,9.71 30.74,9.71 ; v1(33.55,11.28) 33.84,11.57 33.94,11.57 ; v1(33.56,13.67) 33.7,13.52 33.94,13.52 ; v1(39.97,5.98) 39.58,6.37 39.54,6.37 ; 18.56,15.58 18.22,15.91 ; 18.56,15.58 18.89,15.25 v1(18.89,15.19) ; v1(31.8,11.38) 31.99,11.57 32.34,11.57 ; v1(31.85,17.42) 32.32,17.42 UD1.D1 ; 32.34,7.67 31.65,7.67 31.34,7.36 31.34,7.21 ; 16.81,11.67 17.16,12.02 ; 17.16,12.02 17.52,12.38 ; 41.14,11.57 41.14,11.68 v1(41.4,11.94) ; 29.89,15.6 29.69,15.8 29.69,16.06 R1.2 ; 29.89,15.6 28.58,15.6 C5.2 ; C2.1 C18.2 41.91,7.04 v1(41.58,7.37) 41.28,7.67 41.14,7.67 ; 38.74,19.37 38.74,19.74 v1(38.84,19.84) ; v1(31.83,13.67) 31.98,13.52 32.34,13.52 ; 35.54,18.72 v1(35.84,19.02) ; 37.94,17.42 37.75,17.42 v1(37.57,17.6) ; v1(39.91,18.42) 39.6,18.72 39.54,18.72 ; 34.74,19.37 34.74,19.86 v1(34.73,19.87) ; 37.94,10.27 37.94,10.25 v1(37.49,9.8) 37.49,9.41 37.94,8.97 ; v1(35.15,14.48) 35.49,14.82 35.54,14.82 ; 35.54,8.97 35.8,8.97 36.07,9.24 v1(36.07,9.25) ; v1(37.47,18.84) 37.59,18.72 37.94,18.72 ; 33.94,18.72 v1(34.29,18.37)
  Bottom Layer w0.076: 39.78,14.86 40.13,14.86
  Bottom Layer w0.115: v1(19.84,15.36) 19.84,15.37 R3.2
  Bottom Layer w0.203: v1(34.73,19.87) 34.63,19.97 C14.1 ; C16.2 31.78,17.35 v1(31.85,17.42)
  Bottom Layer w0.254: v1(37.49,9.8) 37,10.3 37,10.32 ; v1(33.56,13.67) 33.44,13.55 C15.1 ; v1(33.58,8.59) 33.46,8.47 33.14,8.47 ; v1(39.9,12.98) 40.02,12.87 40.02,12.51 40,12.49 40.04,12.45 40.04,12.15 v1(39.9,12.01) ; 38.15,16.36 37.82,16.36 v1(37.39,15.93) ; v1(36.12,7.42) 36.14,7.39 C24.2 ; v1(34.5,5.31) 34.81,5.62 35.27,5.62 C21.2 ; v1(35.84,19.02) 36.05,19.23 36.44,19.23 ; R5.2 38.03,18.84 v1(37.47,18.84) ; v1(34.29,18.37) 34.29,18.36 C26.2 ; C25.2 36.54,17.74 v1(35.97,17.74) ; C19.1 31.1,15.48 v1(30.94,15.65)
  vias: v1(31.34,7.21)
VDD18-DRAM: length 30.2
  Top Layer w0.254: C28.2 26.87,16.56 v1(26.7,16.74) 27.05,17.09 C27.1 ; C6.1 41.43,20.63 v1(41.4,20.6) 42.24,19.76 C7.2
  Top Layer w0.305: U1.AD25 20.28,14.44 v1(20.32,14.44) ; v1(30.59,18.54) 31.82,19.78 32.78,19.78 v1(32.97,19.96)
  Inner2 w0.305: v1(41.4,20.6) 40.44,21.56 39.52,21.56 38.31,20.35 37.75,20.35 37.26,19.86 36.25,19.86 35.76,20.35 33.35,20.35 32.97,19.98 v1(32.97,19.96) ; v1(30.59,18.54) 30.59,17.61 30.33,17.35 28.02,17.35 27.65,16.98 26.94,16.98 v1(26.7,16.74) 26.47,16.51 25.55,16.51 25.17,16.13 24.08,16.13 22.26,14.31 22.1,14.31 21.49,13.7 21.06,13.7 v1(20.32,14.44)
VDD18-LPDDR: length 36.9
  Top Layer w0.102: 38.74,9.62 v1(39.09,9.96)
  Top Layer w0.254: 32.34,16.12 32.35,16.12 32.72,16.48 v1(32.72,16.53) ; C8.1 41.71,11.52 v1(41.71,11.51) 42.04,11.51 C12.2 ; 41.14,8.97 v1(41.45,9.27) 41.78,8.95 42.16,8.95 C11.2 ; 42.24,16.51 42.08,16.51 v1(41.68,16.12) 41.14,16.12 ; 34.74,9.62 35.15,9.2 v1(35.15,9.2) ; v1(38.36,15.08) 38.74,15.47 ; v1(35.17,15.89) 35.17,15.79 34.85,15.47 34.74,15.47
  Top Layer w0.305: 32.34,8.97 32.66,9.28 v1(32.73,9.28)
  Inner2 w0.254: v1(35.15,9.2) 35.07,9.28 v1(32.73,9.28)
  Inner2 w0.305: v1(35.15,9.2) 35.15,9.67 35.84,10.36 38.69,10.36 v1(39.09,9.96) 40.05,9.96 40.74,9.27 v1(41.45,9.27) 41.33,9.4 41.33,11.19 41.64,11.51 v1(41.71,11.51) ; v1(32.72,16.53) 32.79,16.61 34.62,16.61 35.17,16.06 v1(35.17,15.89) 35.25,15.98 36.16,15.98 36.72,15.42 38.03,15.42 v1(38.36,15.08) 38.36,15.09 39.17,15.9 41.47,15.9 v1(41.68,16.12) 41.71,16.12 42.09,15.73 42.09,13.49 41.68,13.08 v1(41.6,13.08)
  Bottom Layer w0.203: C13.2 33.24,9.28 v1(32.73,9.28)
  Bottom Layer w0.254: 32.39,16.2 32.39,16.21 v1(32.72,16.53)
  Bottom Layer w0.305: v1(41.6,13.08) 41.85,13.08 42.26,12.67 42.26,12.06 v1(41.71,11.51)
SAA0: length 9.3
  Top Layer w0.076: 24.59,15.21 25.03,15.65 26.08,15.65
  Top Layer w0.115: 33.14,14.82 32.83,14.82 32.56,14.55 31.18,14.55 30.71,15.02 26.71,15.02 26.08,15.65
SAA1: length 9.8
  Top Layer w0.076: 25.99,15.29 25.03,15.29 24.59,14.85 24.24,14.85
  Top Layer w0.115: 33.14,14.17 32.73,14.17 32.72,14.15 32.71,14.15 32.45,13.9 32.21,13.9 32.06,14.05 31.16,14.05 30.56,14.66 26.62,14.66 25.99,15.29
SAA2: length 18.5
  Top Layer w0.102: v1(23.55,14.9) 22.87,14.9 22.82,14.85 ; 38.74,14.82 v1(39.14,15.22)
  Inner2 w0.115: v1(23.55,14.9) 23.6,14.9 24.27,15.57 26.7,15.57 27.24,16.11 33.84,16.11 33.85,16.12 34.5,16.12 34.71,15.92 34.71,15.7 34.89,15.52 35.38,15.52 36.04,14.87 36.04,14.87 36.25,14.65 36.25,14.65 36.39,14.51 38.44,14.51 38.55,14.62 38.55,14.62 38.82,14.89 38.82,14.9 v1(39.14,15.22)
SAA3: length 19
  Top Layer w0.102: 22.47,14.5 22.5,14.46 23.17,14.46 23.22,14.51
  Top Layer w0.115: v1(39.21,14.53) 39.26,14.53 39.54,14.82
  Inner2 w0.115: v1(23.22,14.51) 23.23,14.51 23.28,14.46 23.64,14.46 24.5,15.32 27.03,15.32 29.05,13.29 38.01,13.29 39.21,14.48 v1(39.21,14.53)
SAA4: length 19.1
  Top Layer w0.102: v1(40.02,14.49) 40.34,14.82
  Top Layer w0.115: 23.53,14.15 v1(23.85,13.82)
  Inner2 w0.076: 27.31,14.51 24.13,14.51 23.85,14.24
  Inner2 w0.115: v1(40.02,14.49) 40.02,14.16 38.77,12.92 28.9,12.92 27.31,14.51 ; v1(23.85,13.82) 23.85,14.24
SAA5: length 19.1
  Top Layer w0.115: v1(40.77,14.48) 40.65,14.48 40.34,14.17 ; v1(24.26,14.18) 24.2,14.18 23.88,14.5
  Inner2 w0.076: v1(24.26,14.18) 24.3,14.22 26.97,14.22
  Inner2 w0.115: v1(40.77,14.48) 40.77,14.4 38.92,12.55 28.65,12.55 26.97,14.22
SAB0: length 13
  Top Layer w0.115: 21.76,12.38 21.76,12.43 v1(22.06,12.73) ; v1(29.57,10.26) 30.76,10.26 31.04,10.54 32.87,10.54 33.14,10.27
  Inner2 w0.076: v1(22.06,12.73) 22.78,12.73 23.55,11.96 23.95,11.96 24.48,11.43 25.3,11.43 26.25,11.45
  Inner2 w0.115: v1(29.57,10.26) 29.34,10.03 28.6,10.03 28.34,10.28 27.43,10.28 26.25,11.45
SAB1: length 13.6
  Top Layer w0.115: v1(28.84,10.4) 28.89,10.4 29.16,10.67 29.84,10.67 30.26,11.08 30.96,11.08 31.06,10.97 31.9,10.97 32.16,11.23 32.49,11.23 32.8,10.92 33.14,10.92 ; 21.41,12.73 21.41,12.83 v1(21.68,13.11)
  Inner2 w0.076: 26.07,12.15 23.59,12.15 22.83,12.9 22.5,12.9 22.3,13.11 v1(21.68,13.11)
  Inner2 w0.115: v1(28.84,10.4) 28.82,10.4 28.56,10.66 27.57,10.66 26.07,12.15
SAB2: length 19.3
  Top Layer w0.102: v1(38.36,9.88) 38.74,10.27
  Top Layer w0.115: 22.47,11.67 v1(22.79,12)
  Inner2 w0.076: 25.43,10.92 25.32,11.02 24.38,11.02 23.99,11.42 23.37,11.42 v1(22.79,12)
  Inner2 w0.115: 25.43,10.92 25.74,10.92 28.43,8.23 31.24,8.23 31.51,7.95 32.42,7.95 32.62,8.15 37.01,8.15 37.64,8.79 37.64,9.17 v1(38.36,9.88)
SAB3: length 20.9
  Top Layer w0.115: 39.54,10.27 39.22,10.59 37.59,10.59 37.12,10.12 v1(37.12,8.85) ; v1(22.42,12.37) 22.11,12.07 22.11,12.02
  Inner2 w0.076: v1(22.42,12.37) 22.92,12.37 23.53,11.76 23.9,11.76 24.46,11.2 25.43,11.2 25.5,11.12 25.88,11.12
  Inner2 w0.115: 25.88,11.12 26.06,11.12 28.35,8.83 33.31,8.83 33.45,8.97 34.62,8.97 34.82,8.76 35.64,8.76 35.76,8.89 37.09,8.89 v1(37.12,8.85)
SAB4: length 20.6
  Top Layer w0.102: v1(22.8,13.37) 22.79,13.35 22.73,13.35 22.47,13.09 ; 40.34,10.27 39.99,10.62 v1(39.93,10.62)
  Inner2 w0.076: 24,12.67 23.31,13.37 v1(22.8,13.37)
  Inner2 w0.115: v1(39.93,10.62) 39.19,10.62 38.15,11.66 34.95,11.66 34.8,11.51 34.8,11.05 34.53,10.78 34.15,10.78 34.03,10.9 31.06,10.9 30.54,11.43 27.89,11.43 26.26,13.06 25.51,13.06 25.13,12.67 24,12.67
SAB5: length 17.9
  Top Layer w0.102: v1(39.96,11.29) 40.34,10.92
  Top Layer w0.115: 23.88,13.09 v1(24.22,13.42)
  Inner2 w0.115: v1(24.22,13.42) 24.51,13.72 26.36,13.72 26.64,13.44 26.95,13.44 28.22,12.17 39.09,12.17 v1(39.96,11.29)
SCKE0-A: length 10.9
  Top Layer w0.076: 26.27,13 25.74,13 25.55,13.19 25.55,13.19 25.4,13.34 25.05,13.34 24.94,13.44
  Top Layer w0.115: v1(34.32,13.84) 34.42,13.84 34.74,14.16 34.74,14.17 ; 26.27,13 26.42,12.85 28.56,12.85 29.18,13.47 30.52,13.47 v1(30.74,13.69)
  Inner2 w0.115: v1(30.74,13.69) 31.27,14.22 33.05,14.22 33.22,14.05 33.76,14.05 33.97,13.84 v1(34.32,13.84)
SCKE0-B: length 13.2
  Top Layer w0.076: 23.88,11.67 24.53,11.02 25.06,11.02 25.64,10.44
  Top Layer w0.102: v1(35.16,10.62) 34.86,10.92 34.74,10.92
  Top Layer w0.115: 25.64,10.44 25.8,10.44 26.07,10.17 27.2,10.17 27.83,9.54 28.92,9.54 v1(29.02,9.64)
  Inner2 w0.115: v1(35.16,10.62) 35.01,10.48 34.1,10.48 33.71,10.09 31.76,10.09 31.29,9.63 29.03,9.63 v1(29.02,9.64)
SCKE1-A: length 13.3
  Top Layer w0.076: 26.47,13.54 25.9,13.54 25.75,13.69 25.55,13.69 25.4,13.54 25.19,13.54 24.94,13.79 24.59,13.79
  Top Layer w0.102: v1(35.89,14.5) 35.55,14.17 35.54,14.17
  Top Layer w0.115: 26.47,13.54 26.51,13.49 28.33,13.49 29.08,14.25 v1(29.31,14.25)
  Inner2 w0.115: v1(29.31,14.25) 29.71,13.85 30.36,13.85 31.05,14.54 33.08,14.54 33.33,14.78 33.73,14.78 34.3,14.21 34.56,14.21 34.65,14.12 35.51,14.12 v1(35.89,14.5)
SCKE1-B: length 15.2
  Top Layer w0.076: 23.53,12.02 23.88,12.02 24.68,11.23 25.09,11.23 25.68,10.64 25.87,10.64
  Top Layer w0.102: 35.54,10.92 35.85,11.23 v1(35.89,11.23)
  Top Layer w0.115: v1(28.05,9.9) 28.05,10.05 27.57,10.54 25.97,10.54 25.87,10.64
  Inner2 w0.115: v1(35.89,11.23) 35.89,10.86 34.71,9.68 31.87,9.68 31.38,9.19 28.91,9.19 28.23,9.88 28.08,9.88 v1(28.05,9.9)
SCKN-A: length 15.6
  Top Layer w0.076: 38.47,13.21 38.47,13.23 38.44,13.26 38.44,14.08 38.53,14.17 38.74,14.17 ; 26.26,12.09 26.23,12.12 25.62,12.12 25.01,12.73 24.94,12.73
  Top Layer w0.127: 38.47,13.21 38.47,12.93 38.24,12.7 29.66,12.7 29.04,12.09 26.26,12.09
SCKN-B: length 16.1
  Top Layer w0.076: 37.72,12.29 37.73,12.29 37.78,12.24 38.09,12.24 38.46,11.87 38.46,11.03 38.56,10.92 38.74,10.92 ; 26.35,11.37 26.32,11.34 25.72,11.34 25.17,11.88 25.17,12 24.87,12.31 24.66,12.31 24.59,12.38
  Top Layer w0.127: 26.35,11.37 26.48,11.5 29.17,11.5 29.96,12.29 37.72,12.29
SCKP-A: length 15.6
  Top Layer w0.076: 26.26,12.34 26.25,12.34 26.22,12.32 25.71,12.32 24.94,13.09 24.59,13.09 ; 37.94,14.17 38.16,14.17 38.24,14.09 38.24,13.26 38.21,13.23 38.21,13.21
  Top Layer w0.127: 26.26,12.34 28.94,12.34 29.55,12.96 38.14,12.96 38.21,13.03 38.21,13.21
SCKP-B: length 16.9
  Top Layer w0.076: 37.72,12.03 38,12.03 38.29,11.75 38.29,10.99 38.21,10.92 37.94,10.92 ; 23.88,12.38 23.83,12.43 23.83,12.52 23.9,12.6 24.02,12.6 24.51,12.1 24.78,12.1 24.97,11.92 24.97,11.84 25.67,11.14 26.48,11.14
  Top Layer w0.127: 37.72,12.03 30.06,12.03 29.27,11.24 26.58,11.24 26.48,11.14
SCS0-A: length 11.2
  Top Layer w0.076: 25.65,13.44 25.79,13.3 26.4,13.3
  Top Layer w0.115: v1(30.2,14.25) 29.81,13.86 29.1,13.86 28.42,13.18 26.52,13.18 26.4,13.3 ; 34.74,14.82 34.86,14.82 35.15,15.11 v1(35.15,15.11)
  Inner2 w0.115: v1(35.15,15.11) 34.74,14.69 34.21,14.69 33.85,15.05 32.92,15.05 32.78,14.91 30.86,14.91 v1(30.2,14.25)
SCS0-B: length 14.8
  Top Layer w0.102: v1(34.37,11.23) 34.37,10.87 34.74,10.5 34.74,10.27
  Top Layer w0.115: 23.53,13.44 22.99,13.98 v1(22.99,14.06)
  Inner2 w0.115: v1(34.37,11.23) 33.79,11.8 28.04,11.8 26.75,13.1 26.57,13.1 26.34,13.32 25.24,13.32 24.95,13.03 24.1,13.03 23.17,13.97 23.08,13.97 22.99,14.06
SCS1-A: length 10.3
  Top Layer w0.076: 26.13,14.27 25.75,13.9 25.4,13.9 25.3,13.79
  Top Layer w0.115: v1(34.35,15.09) 34.34,15.09 34.31,15.06 34.29,15.06 34.05,14.82 33.94,14.82 ; 26.13,14.27 v1(28.58,14.27)
  Inner2 w0.115: v1(34.35,15.09) 34.34,15.09 34.06,15.37 32.01,15.37 31.93,15.29 29.59,15.29 v1(28.58,14.27)
SCS1-B: length 12.5
  Top Layer w0.102: 22.82,12.73 23.12,13.03 v1(23.18,13.03)
  Top Layer w0.115: v1(33.66,10.54) 33.94,10.27
  Inner2 w0.076: 26.42,12.33 23.88,12.33 v1(23.18,13.03)
  Inner2 w0.115: 26.42,12.33 27.7,11.05 29.61,11.05 30.31,10.36 30.91,10.36 31.01,10.46 33.58,10.46 v1(33.66,10.54)
SDQ0: length 18.5
  Top Layer w0.115: v1(21.65,14.52) 21.41,14.77 21.41,14.85 ; v1(35.13,17.06) 35.12,17.06 35.1,17.04 35.05,17.04 34.78,16.77 34.74,16.77
  Inner2 w0.115: v1(35.13,17.06) 35.04,17.06 33.74,18.36 33.74,18.37 33.13,18.98 32.67,18.98 31.39,20.26 29.22,20.26 28.84,19.88 27.34,19.88 25.57,18.11 24.79,18.11 23.6,16.92 23.37,16.92 21.65,15.2 v1(21.65,14.52)
SDQ1: length 22.2
  Top Layer w0.076: v1(21.28,14.18) 21.28,14.28 21.05,14.5
  Top Layer w0.115: v1(36.04,16.53) 36.02,16.51 35.92,16.51 35.91,16.5 35.12,16.5 34.74,16.12 34.74,16.12
  Inner2 w0.115: v1(36.04,16.53) 35.51,17.07 35.51,17.86 33.9,19.48 32.78,19.48 31.57,20.68 28.87,20.68 28.6,20.41 27.29,20.41 25.24,18.36 24.72,18.36 23.58,17.23 23.21,17.23 21.28,15.29 v1(21.28,14.18)
SDQ2: length 11.8
  Top Layer w0.076: 25.1,16.26 24.58,16.26 23.88,15.56 23.53,15.56
  Top Layer w0.115: 25.1,16.26 25.56,16.71 25.81,16.71 26.69,17.6 27.17,17.6 27.29,17.71 27.29,17.87 27.4,17.98 27.56,17.98 27.67,17.87 27.67,17.71 27.78,17.6 27.94,17.6 28.05,17.71 28.05,17.87 28.16,17.98 28.32,17.98 28.43,17.87 28.43,17.71 28.95,17.2 31.24,17.2 31.37,17.07 32.84,17.07 33.14,16.77
SDQ3: length 10.1
  Top Layer w0.076: 24.24,15.56 24.74,16.06 25.23,16.06
  Top Layer w0.115: 33.14,16.12 32.78,16.12 32.51,15.85 32.14,15.85 31.22,16.77 29.6,16.77 28.97,16.14 26.6,16.14 26.34,16.41 25.58,16.41 25.23,16.06
SDQ4: length 13.5
  Top Layer w0.115: 33.14,18.72 32.81,19.05 31.83,19.05 30.81,18.03 v1(30.02,18.03) ; v1(22.45,15.23) 22.12,15.56 22.11,15.56
  Inner2 w0.115: v1(22.45,15.23) 22.45,15.72 22.78,16.06 23.07,16.06 24.3,17.29 25.4,17.29 26.49,18.39 29.67,18.39 v1(30.02,18.03)
SDQ5: length 15.3
  Top Layer w0.076: 24.64,18.21 23.48,17.05 23.25,17.05 22.82,16.62 22.47,16.62
  Top Layer w0.115: 34.74,18.72 34.37,19.09 34.37,19.99 33.72,20.64 27.17,20.64 25.17,18.64 25.07,18.64 24.64,18.21
SDQ6: length 12.4
  Top Layer w0.115: 22.47,15.91 22.52,15.91 v1(22.83,15.6) ; 33.14,18.07 32.77,18.44 31.83,18.44 31,17.61 29.4,17.61 v1(29.11,17.91)
  Inner2 w0.115: v1(29.11,17.91) 26.78,17.91 25.84,16.97 24.31,16.97 22.94,15.6 v1(22.83,15.6)
SDQ7: length 16.7
  Top Layer w0.076: 22.82,16.97 23.2,17.35 23.55,17.35 24.07,17.88 24.07,18.14
  Top Layer w0.115: 24.07,18.14 26.99,21.06 34.09,21.06 35.1,20.04 35.1,18.43 34.74,18.07
SDQ8: length 24.7
  Top Layer w0.115: 20.35,15.21 20.35,15.58 v1(20.24,15.69) ; 38.74,16.77 38.41,17.1 37.51,17.1 37.06,17.55 v1(37.06,20.4)
  Inner2 w0.076: v1(20.24,15.69) 21.28,15.69
  Inner2 w0.115: v1(37.06,20.4) 36.4,20.4 36.01,20.79 36.01,20.79 35.99,20.8 32.05,20.8 31.75,21.1 28.7,21.1 28.55,20.95 27.23,20.95 25.06,18.78 24.8,18.78 23.5,17.48 23.06,17.48 21.28,15.69
SDQ9: length 25.5
  Top Layer w0.115: 38.74,16.12 38.65,16.2 38.32,16.2 38.11,16.42 37.03,16.42 36.64,16.8 36.64,20.86 v1(36.58,20.93) ; 20.7,15.56 20.7,15.96 v1(20.63,16.03)
  Inner2 w0.076: 23.42,18.39 21.06,16.03 v1(20.63,16.03)
  Inner2 w0.115: 23.42,18.39 24.02,18.39 27.05,21.41 28.4,21.41 28.51,21.52 31.92,21.52 32.22,21.22 36.28,21.22 v1(36.58,20.93)
SDQ10: length 23.8
  Top Layer w0.076: 21.41,16.27 21.41,16.27 v1(21.08,16.6)
  Top Layer w0.115: v1(38.1,20.85) 38.1,20.5 38.46,20.14 38.46,19 38.74,18.72
  Inner2 w0.076: v1(21.08,16.6) 21.08,17.08 21.32,17.32 21.86,17.32 23.02,18.48 23.02,18.58 23.34,18.91
  Inner2 w0.115: 23.34,18.91 27.08,22.65 28.38,22.65 28.63,22.4 37.08,22.4 38.1,21.37 v1(38.1,20.85)
SDQ11: length 23.2
  Top Layer w0.115: v1(21.46,16.98) 21.76,16.67 21.76,16.62 ; 38.74,18.07 38.58,18.07 38.31,18.34 38.31,18.82 38.1,19.02 37.85,19.02 37.59,19.28 37.59,20.85 v1(37.36,21.08)
  Inner2 w0.076: 23.42,18.67 21.73,16.98 v1(21.46,16.98)
  Inner2 w0.115: 23.42,18.67 23.7,18.67 27.26,22.23 28.15,22.23 28.18,22.2 28.19,22.2 28.41,21.98 36.9,21.98 37.47,21.41 37.47,21.18 v1(37.36,21.08)
SDQ12: length 26.1
  Top Layer w0.076: 22.09,18.93 22,18.83 22,18.27 21.76,18.03
  Top Layer w0.115: 22.09,18.93 23.35,20.18 23.35,20.39 26.54,23.58 38.36,23.58 40.76,21.19 40.76,19.72 40.8,19.67 40.8,18.53 40.34,18.07
SDQ13: length 25.4
  Top Layer w0.076: 21.05,17.33 21.41,17.33 22.2,18.12 22.2,18.67 22.33,18.8
  Top Layer w0.115: 40.34,18.72 40.46,18.84 40.46,19.11 40.61,19.25 40.61,19.48 40.5,19.59 40.5,20.86 38.19,23.17 26.72,23.17 23.64,20.09 23.62,20.09 22.33,18.8
SDQ14: length 33.2
  Top Layer w0.115: v1(40.74,16.46) 40.4,16.12 40.34,16.12 ; 19.99,16.27 19.98,16.27 v1(19.66,16.59)
  Inner2 w0.076: v1(19.66,16.59) 20.1,16.59 22.02,18.5 22.02,18.51
  Inner2 w0.115: 22.02,18.51 22.02,18.84 26.76,23.57 39.93,23.57 42.27,21.23 42.27,17.87 42.16,17.77 42.16,17.75 41.67,17.25 41.58,17.25 40.79,16.46 v1(40.74,16.46)
SDQ15: length 32.1
  Top Layer w0.115: 19.64,15.91 19.61,15.91 v1(19.25,16.28) ; v1(40.79,17.09) 40.77,17.07 40.77,17.02 40.52,16.77 40.34,16.77
  Inner2 w0.076: v1(19.25,16.28) 19.35,16.18 19.97,16.18 22.25,18.46
  Inner2 w0.115: v1(40.79,17.09) 40.79,17.28 41.18,17.66 41.18,18.59 41.81,19.23 41.81,21.03 39.69,23.15 26.93,23.15 23.11,19.33 22.78,19.33 22.25,18.8 22.25,18.46
SDQ16: length 11.5
  Top Layer w0.076: 22.82,11.32 23.17,11.32 23.49,11 23.94,11 24.66,10.29
  Top Layer w0.115: 33.14,8.97 32.86,8.68 30.38,8.68 29.94,9.12 27.65,9.12 27.02,9.75 25.9,9.75 25.36,10.29 24.66,10.29
SDQ17: length 11.4
  Top Layer w0.076: 23.17,10.96 23.34,10.8 23.66,10.8 24.47,9.98
  Top Layer w0.115: 24.47,9.98 25.07,9.98 25.76,9.3 26.75,9.3 27.36,8.69 29.78,8.69 30.51,7.95 32.78,7.95 33.14,8.32
SDQ18: length 19.7
  Top Layer w0.115: v1(21.09,12.36) 20.75,12.02 20.7,12.02 ; 34.74,8.97 34.73,8.92 35.22,8.27 35.22,7.34
  Inner2 w0.076: v1(21.09,12.36) 21.12,12.33 21.63,12.33 21.74,12.22 21.9,12.22 23.04,11.07 23.65,11.07 24.63,10.09
  Inner2 w0.115: 24.63,10.09 25.41,10.09 26.93,8.57 27.68,7.51 29.15,6.03 33.75,6.03 34.55,6.83 35.13,7.26 35.2,7.34 v1(35.22,7.34)
SDQ19: length 14
  Top Layer w0.115: 21.41,11.32 21.72,11.63 v1(21.8,11.63) ; v1(26.42,8.56) 26.71,8.27 29.6,8.27 31.12,6.75 32.74,6.75 33.01,7.02 33.14,7.02
  Inner2 w0.076: v1(21.8,11.63) 22.25,11.63 23.12,10.77 23.57,10.77 24.52,9.82
  Inner2 w0.115: v1(26.42,8.56) 26.35,8.56 25.09,9.82 24.52,9.82
SDQ20: length 18.4
  Top Layer w0.076: v1(35.12,6.65) 35.1,6.67 35.1,6.99 34.94,7.16 34.94,7.18 34.88,7.23 34.88,7.39 34.9,7.41 34.9,7.48 35.04,7.62 35.04,7.91 34.69,8.26
  Top Layer w0.115: 21.76,10.96 21.84,10.96 v1(22.15,11.28)
  Inner2 w0.076: 24.43,9.53 23.42,10.54 22.89,10.54 v1(22.15,11.28)
  Inner2 w0.115: 24.43,9.53 24.78,9.53 26.81,7.5 27.1,7.5 28.98,5.61 34.29,5.61 34.34,5.67 34.45,5.67 35.12,6.34 v1(35.12,6.65)
SDQ21: length 14.1
  Top Layer w0.076: 23.82,8.61 23.11,8.61 22.25,9.47 22.19,9.47 21.76,9.9 21.76,10.26
  Top Layer w0.115: 23.82,8.61 26.33,6.11 28.65,6.11 29.31,5.45 32.45,5.45 33.14,6.14 33.14,6.37
SDQ22: length 16.8
  Top Layer w0.076: 21.76,9.55 22.03,9.28 22.23,9.28 23.05,8.46 23.07,8.46 23.14,8.38 23.45,8.38
  Top Layer w0.115: 34.74,6.37 34.81,6.37 35.18,5.99 35.18,5.31 34.75,4.88 33,4.88 32.85,5.03 29.14,5.03 28.47,5.69 26.14,5.69 23.45,8.38
SDQ23: length 19.4
  Top Layer w0.115: 19.64,11.67 20.01,12.04 v1(20.01,12.05) ; 34.74,7.02 34.55,7.02 34.24,6.71 33.83,6.71 33.56,6.43 33.56,5.46 v1(33.31,5.22)
  Inner2 w0.076: v1(20.01,12.05) 20.92,12.05 22.65,10.31 23.37,10.31 24.31,9.38 24.31,9.35
  Inner2 w0.115: v1(33.31,5.22) 33.27,5.18 28.76,5.18 26.87,7.08 26.64,7.08 24.41,9.31 24.31,9.35
SDQ24: length 24
  Top Layer w0.115: 38.74,6.37 38.4,6.02 37.82,6.02 35.99,4.19 28.73,4.19 28.07,4.85 26.8,4.85 v1(26.73,4.78) ; v1(19.32,11.37) 19.29,11.33 19.29,11.32 18.93,10.96
  Inner2 w0.076: 22.33,9.22 20.18,11.37 v1(19.32,11.37)
  Inner2 w0.115: v1(26.73,4.78) 26.63,4.78 26.57,4.84 26.51,4.84 22.33,9.02 22.33,9.22
SDQ25: length 27.1
  Top Layer w0.115: 40.34,6.37 40.61,6.09 40.61,5.26 40.16,4.8 39.41,4.8 39.15,4.55 38.18,4.55 36.98,3.35 28.38,3.35 27.74,3.99 27.13,3.99 27.06,3.93 v1(26.99,3.93) ; v1(19.67,10.98) 19.64,10.95 19.64,10.91 19.34,10.61 19.29,10.61
  Inner2 w0.076: 22.02,9.12 22.02,9.31 20.41,10.92 19.73,10.92 v1(19.67,10.98)
  Inner2 w0.115: 22.02,9.12 22.02,8.92 22.89,8.06 22.89,7.87 23.11,7.65 23.11,7.65 26.39,4.36 26.4,4.36 26.83,3.93 v1(26.99,3.93)
SDQ26: length 29
  Top Layer w0.115: v1(20.38,10.22) 20.07,9.9 19.99,9.9 ; v1(40.77,8) 40.45,8.32 40.34,8.32
  Inner2 w0.076: v1(20.38,10.22) 20.42,10.25 20.86,10.25 21.51,9.6 21.51,9.25
  Inner2 w0.115: v1(40.77,8) 40.36,7.59 40.36,4.28 39.34,3.25 26.91,3.25 26.22,3.94 26.22,3.94 22.81,7.35 22.62,7.35 21.82,8.15 21.81,8.15 21.51,8.44 21.51,9.25
SDQ27: length 27.8
  Top Layer w0.115: v1(20.75,9.87) 20.67,9.87 20.35,9.55 ; v1(40.79,4.73) 40.84,4.78 40.84,6.51 UD1.Y11
  Inner2 w0.076: v1(20.75,9.87) 21.21,9.41 21.21,9.34
  Inner2 w0.115: v1(40.79,4.73) 40.79,4.11 39.51,2.83 26.74,2.83 26.05,3.52 26.05,3.52 22.51,7.05 22.51,7.12 21.21,8.42 21.21,9.34
SDQ28: length 23
  Top Layer w0.076: 21.41,9.9 21.41,9.55 21.87,9.09 22.19,9.09 23.23,8.05 23.23,8
  Top Layer w0.115: 38.74,8.97 38.6,8.97 38.27,8.64 37.44,8.64 36.98,8.18 36.98,5.7 35.9,4.61 28.96,4.61 28.3,5.27 25.97,5.27 23.23,8
SDQ29: length 26.8
  Top Layer w0.115: v1(40.74,8.71) 40.49,8.97 40.34,8.97 ; v1(21.46,10.58) 21.14,10.26 21.05,10.26
  Inner2 w0.076: v1(21.46,10.58) 21.74,10.29 21.74,10.22 22.61,9.36
  Inner2 w0.115: v1(40.74,8.71) 40.34,8.31 39.7,8.31 39.57,8.43 39.11,8.43 38.78,8.1 38.78,6.15 38.26,5.64 38.26,5.2 36.98,3.92 28.2,3.92 26.87,5.26 26.68,5.26 23.3,8.64 23.04,8.64 22.61,9.07 22.61,9.36
SDQ30: length 22.2
  Top Layer w0.102: v1(38.33,6.6) 38.74,7.02
  Top Layer w0.115: 20.7,10.61 20.77,10.61 v1(21.09,10.93)
  Inner2 w0.076: v1(21.09,10.93) 21.57,10.93 21.97,10.53 21.97,10.34 22.89,9.42 23.07,9.42
  Inner2 w0.115: 23.07,9.42 23.29,9.42 23.64,9.08 23.64,8.89 26.69,5.84 26.87,5.84 28.38,4.34 36.07,4.34 v1(38.33,6.6)
SDQ31: length 23.8
  Top Layer w0.115: 38.74,8.32 38.47,8.04 v1(38.42,8.04) ; v1(20.36,11.67) 20.36,11.63 20.04,11.32 19.99,11.32
  Inner2 w0.076: 23.52,9.65 23.06,9.65 21.07,11.64 20.38,11.64 v1(20.36,11.67)
  Inner2 w0.115: v1(38.42,8.04) 38.42,7.97 38,7.55 38,7.16 37.79,6.95 37.55,6.95 37.03,6.44 37.03,5.94 35.85,4.76 28.55,4.76 27.05,6.26 26.86,6.26 24.29,8.83 24.29,8.88 23.52,9.65
SDQM0: length 14.2
  Top Layer w0.076: 24.85,18.07 23.64,16.86 23.41,16.86 23.17,16.62 23.17,16.62
  Top Layer w0.115: 33.94,18.07 33.56,18.45 33.56,19.99 33.18,20.36 32.76,20.36 32.62,20.22 31.9,20.22 31.9,20.22 27.39,20.22 25.34,18.17 24.94,18.17 24.85,18.07
SDQM1: length 23.2
  Top Layer w0.076: 22.11,16.97 22.47,16.97 23.11,17.62 23.59,17.62 23.78,17.81 23.78,18.37
  Top Layer w0.115: 23.78,18.37 23.78,18.44 26.82,21.48 34.2,21.48 34.51,21.16 34.51,21.03 34.93,20.61 35.44,20.61 35.64,20.81 35.64,21.23 35.85,21.44 38.03,21.44 38.46,21.02 38.46,20.77 39.22,20.01 39.22,18.39 39.54,18.07
SDQM2: length 13.9
  Top Layer w0.076: 22.47,10.96 22.82,10.96 23.24,10.54 23.55,10.54 24.33,9.75
  Top Layer w0.115: 24.33,9.75 24.63,9.75 26.54,7.85 29.43,7.85 31.18,6.1 32.45,6.1 33.06,6.71 33.42,6.71 33.65,6.93 33.86,6.93 33.94,7.02
